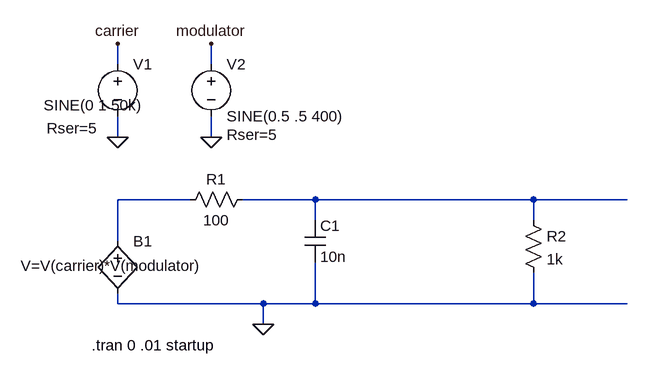
[diagram p0: schematic Modulation-demodulation.asc]
Modulation-demodulation.asc, the LTspice schematic file:
Version 4
SHEET 1 880 680
WIRE 16 48 16 16
WIRE 160 48 160 16
WIRE 16 160 16 128
WIRE 160 160 160 128
WIRE 128 256 16 256
WIRE 320 256 208 256
WIRE 656 256 320 256
WIRE 800 256 656 256
WIRE 320 288 320 256
WIRE 656 288 656 256
WIRE 16 320 16 256
WIRE 16 416 16 400
WIRE 240 416 16 416
WIRE 320 416 320 352
WIRE 320 416 240 416
WIRE 656 416 656 368
WIRE 656 416 320 416
WIRE 800 416 656 416
WIRE 240 448 240 416
FLAG 16 16 carrier
FLAG 160 16 modulator
FLAG 16 160 0
FLAG 160 160 0
FLAG 240 448 0
SYMBOL voltage 16 32 R0
WINDOW 3 -114 79 Left 2
WINDOW 123 0 0 Left 0
WINDOW 39 -109 114 Left 2
SYMATTR InstName V1
SYMATTR Value SINE(0 1 50k)
SYMATTR SpiceLine Rser=5
SYMBOL voltage 160 32 R0
WINDOW 123 0 0 Left 0
WINDOW 39 24 124 Left 2
SYMATTR InstName V2
SYMATTR Value SINE(0.5 .5 400)
SYMATTR SpiceLine Rser=5
SYMBOL res 224 240 R90
WINDOW 0 0 56 VBottom 2
WINDOW 3 32 56 VTop 2
SYMATTR InstName R1
SYMATTR Value 100
SYMBOL res 640 272 R0
SYMATTR InstName R2
SYMATTR Value 1k
SYMBOL bv 16 304 R0
WINDOW 3 -149 54 Left 2
SYMATTR InstName B1
SYMATTR Value V=V(carrier)*V(modulator)
SYMBOL cap 304 288 R0
SYMATTR InstName C1
SYMATTR Value 10n
TEXT -24 480 Left 2 !.tran 0 .01 startup

The netlist it stands for:
* Modulation-demodulation.asc
V1 carrier 0 SINE(0 1 50k) Rser=5
V2 modulator 0 SINE(0.5 .5 400) Rser=5
R1 N002 N001 100
R2 N002 0 1k
B1 N001 0 V=V(carrier)*V(modulator)
C1 N002 0 10n
.tran 0 .01 startup
.backanno
.end